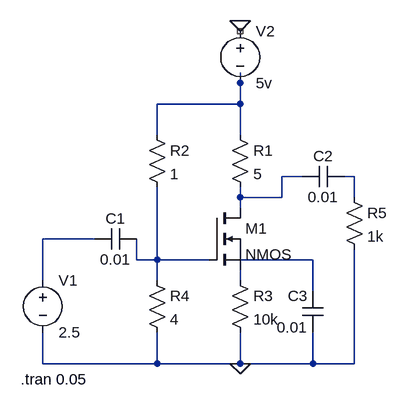
[diagram p0: schematic (2)cs amplifier emosfet.asc]
(2)cs amplifier emosfet.asc, the LTspice schematic file:
Version 4
SHEET 1 880 680
WIRE 208 16 208 0
WIRE 208 48 208 16
WIRE 208 48 80 48
WIRE 80 96 80 48
WIRE 208 96 208 48
WIRE 304 160 272 160
WIRE 384 160 368 160
WIRE 208 192 208 176
WIRE 272 192 272 160
WIRE 272 192 208 192
WIRE 384 192 384 160
WIRE 208 208 208 192
WIRE -16 256 -96 256
WIRE 48 288 48 256
WIRE 80 288 80 176
WIRE 80 288 48 288
WIRE 160 288 80 288
WIRE 320 288 208 288
WIRE -96 320 -96 256
WIRE 80 320 80 288
WIRE 208 320 208 304
WIRE 320 336 320 288
WIRE -96 448 -96 400
WIRE 80 448 80 400
WIRE 80 448 -96 448
WIRE 208 448 208 400
WIRE 208 448 80 448
WIRE 320 448 320 400
WIRE 320 448 208 448
WIRE 384 448 384 272
WIRE 384 448 320 448
FLAG 208 448 0
FLAG 208 -80 0
SYMBOL res 192 80 R0
SYMATTR InstName R1
SYMATTR Value 5
SYMATTR SpiceLine pwr=3k
SYMBOL res 64 80 R0
SYMATTR InstName R2
SYMATTR Value 1
SYMATTR SpiceLine pwr=100k
SYMBOL res 192 304 R0
SYMATTR InstName R3
SYMATTR Value 10k
SYMBOL res 64 304 R0
SYMATTR InstName R4
SYMATTR Value 4
SYMATTR SpiceLine pwr=50k
SYMBOL res 368 176 R0
SYMATTR InstName R5
SYMATTR Value 1k
SYMBOL cap 48 240 R90
WINDOW 0 0 32 VBottom 2
WINDOW 3 32 32 VTop 2
SYMATTR InstName C1
SYMATTR Value 0.01
SYMBOL cap 368 144 R90
WINDOW 0 0 32 VBottom 2
WINDOW 3 32 32 VTop 2
SYMATTR InstName C2
SYMATTR Value 0.01
SYMBOL cap 336 400 R180
WINDOW 0 24 56 Left 2
WINDOW 3 24 8 Left 2
SYMATTR InstName C3
SYMATTR Value 0.01
SYMBOL voltage -96 304 R0
WINDOW 123 0 0 Left 0
WINDOW 39 0 0 Left 0
SYMATTR InstName V1
SYMATTR Value 2.5
SYMBOL nmos 160 208 R0
SYMATTR InstName M1
SYMBOL voltage 208 -80 R0
WINDOW 123 0 0 Left 0
WINDOW 39 0 0 Left 0
SYMATTR InstName V2
SYMATTR Value 5v
TEXT -130 472 Left 2 !.tran 0.05

The netlist it stands for:
* (2)cs amplifier emosfet.asc
R1 N001 N002 5 pwr=3k
R2 N001 N005 1 pwr=100k
R3 N007 0 10k
R4 N005 0 4 pwr=50k
R5 N003 0 1k
C1 N005 N004 0.01
C2 N003 N002 0.01
C3 0 N006 0.01
V1 N004 0 2.5
M1 N002 N005 N007 N007 NMOS
V2 NC_01 N001 5v
.model NMOS NMOS
.model PMOS PMOS
.lib standard.mos
.tran 0.05
.backanno
.end